# Altium schematic sheet ESP32.SchDoc
size A4
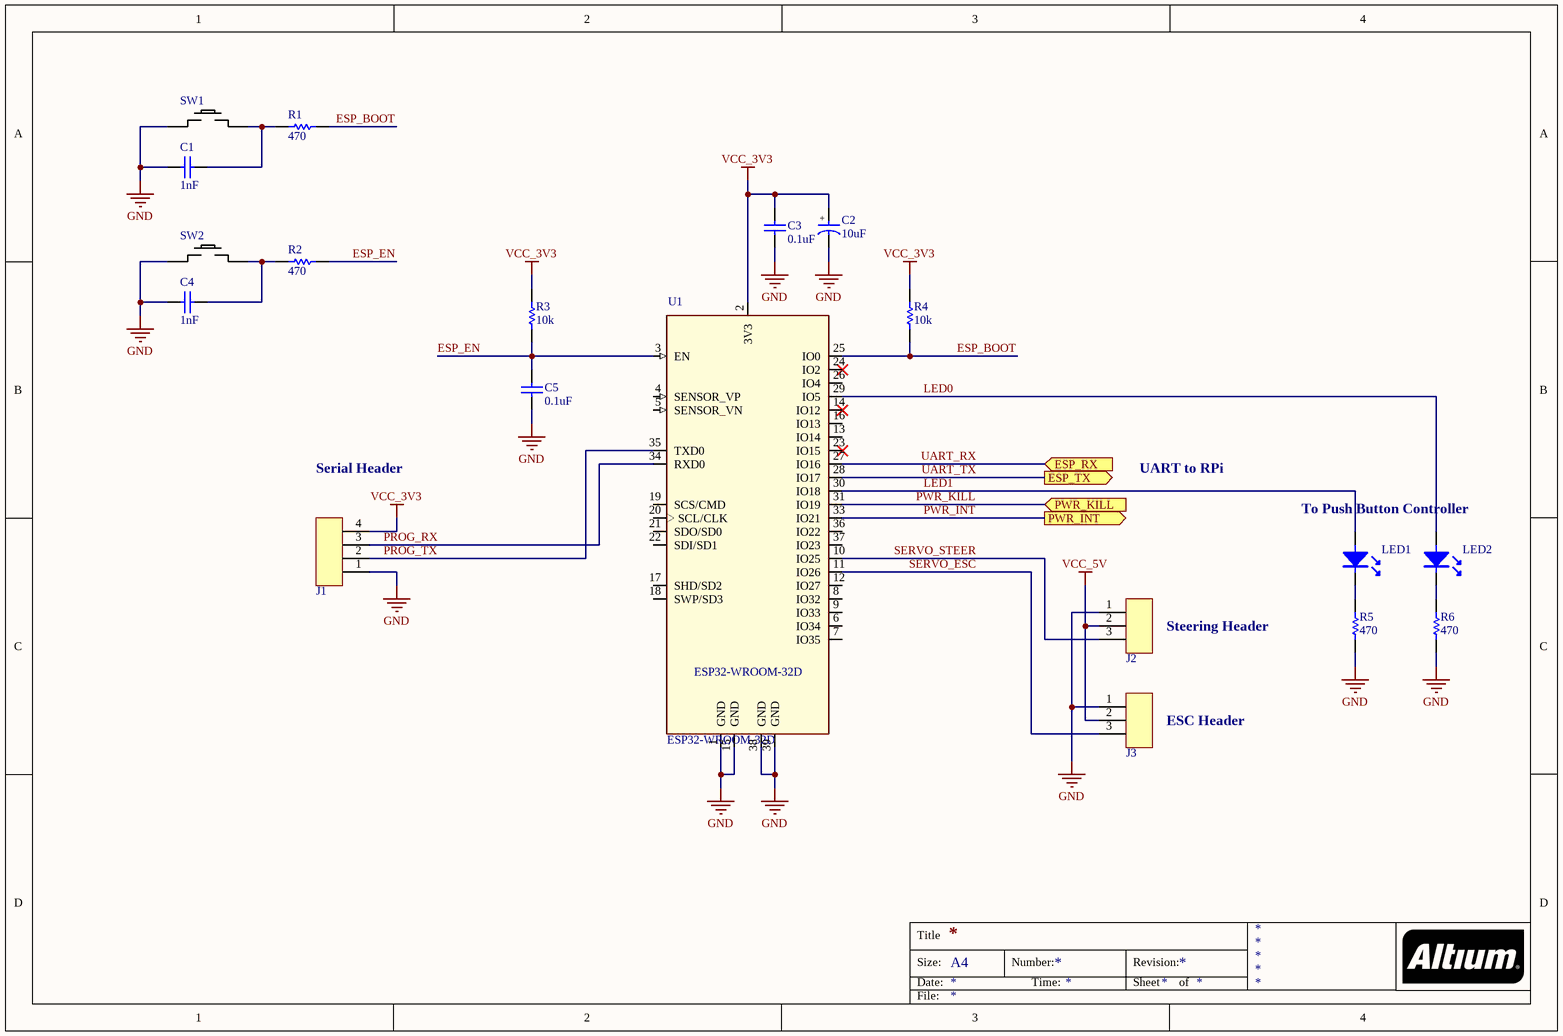
[diagram p0: ESP32.SchDoc]

## Parts
C1  value 1nF  [C0603]  (hidden comment: CAP)
C2  value 10uF  [CASE-A]  (hidden comment: CAP-P)
C3  value 0.1uF  [C0603]  (hidden comment: CAP)
C4  value 1nF  [C0603]  (hidden comment: CAP)
C5  value 0.1uF  [C0603]  (hidden comment: CAP)
J1  HDR_1x4  [PINHEAD_2.54mm_1x4]  (value not drawn)
J2  HDR_1x3  [PINHEAD_2.54mm_1x3]  (value not drawn)
J3  HDR_1x3  [PINHEAD_2.54mm_1x3]  (value not drawn)
LED1  LED  [0603-LED]  (value not drawn)
LED2  LED  [0603-LED]  (value not drawn)
R1  value 470  [R0603]  (hidden comment: RES)
R2  value 470  [R0603]  (hidden comment: RES)
R3  value 10k  [R0603]  (hidden comment: RES)
R4  value 10k  [R0603]  (hidden comment: RES)
R5  value 470  [R0603]  (hidden comment: RES)
R6  value 470  [R0603]  (hidden comment: RES)
SW1  TACTILE_BUTTON  [TACTILE_BUTTOn]  (value not drawn)
SW2  TACTILE_BUTTON  [TACTILE_BUTTOn]  (value not drawn)
U1  ESP32-WROOM-32D  [ESP32-WROOM-32D]

## Ports
ESP_RX (in), ESP_TX (out), PWR_INT (out), PWR_KILL (in)

## Nets
GND: C1.1 C2.2 C3.2 C4.1 C5.2 J1.1 J2.1 J3.1 R5.2 R6.2 SW1.1 SW2.1 U1.1(GND) U1.15(GND) U1.38(GND) U1.39(GND)
VCC_3V3: C2.1 C3.1 J1.4 R3.1 R4.1 U1.2(3V3)
VCC_5V: J2.2 J3.2
ESP_BOOT: R1.2 R4.2 U1.25(IO0)
ESP_EN: C5.1 R2.2 R3.2 U1.3(EN)
LED0: LED2.A U1.29(IO5)
LED1: LED1.A U1.30(IO18)
PROG_RX: J1.3 U1.34(RXD0)
PROG_TX: J1.2 U1.35(TXD0)
PWR_INT: U1.33(IO21) ; port PWR_INT
PWR_KILL: U1.31(IO19) ; port PWR_KILL
SERVO_ESC: J3.3 U1.11(IO26)
SERVO_STEER: J2.3 U1.10(IO25)
UART_RX: U1.27(IO16) ; port ESP_RX
UART_TX: U1.28(IO17) ; port ESP_TX
NetC1_2: C1.2 R1.1 SW1.2
NetC4_2: C4.2 R2.1 SW2.2
NetLED1_K: LED1.K R5.1
NetLED2_K: LED2.K R6.1

Not connected (* = marked no-connect by the designer): U1 4(SENSOR_VP) 5(SENSOR_VN) 6(IO34) 7(IO35) 8(IO32) 9(IO33) 12(IO27) 13(IO14) 14(IO12)* 16(IO13) 17(SHD/SD2) 18(SWP/SD3) 19(SCS/CMD) 20(SCL/CLK) 21(SDO/SD0) 22(SDI/SD1) 23(IO15)* 24(IO2)* 26(IO4) 36(IO22) 37(IO23)

## Notes on the sheet
- Serial Header
- UART to RPi
- To Push Button Controller
- (near J2) Steering Header
- (near J3) ESC Header
- Title
- Size:
- Date:
- A4
- Number:
- Time:
- Revision:
- Sheet
- of
- File:
- (in symbol CAP-P) +

## Library data of the parts
C1 C4 = CAP: =Description; Voltage: =Voltage
C2 = CAP-P: =Description; Voltage: =Voltage
C3 C5 = CAP: =Description; Voltage: 25V
J1 = HDR_1x4: =Description
J2 J3 = HDR_1x3: =Description
LED1 LED2 = LED: Part_Number: 150060RS75000
R1-R6 = RES: =Description
U1 = ESP32-WROOM-32D: IC: SoC; GPIO, I2C, I2S, IR, SD, SDIO, SPI, UART; 2.7Ã·3.6VDC; 20dBm; Part_Number: ESP-WROOM-32D; MF: Espressif Systems; MP: ESP32-WROOM-32D; Package: Module Espressif Systems; Price: None; Availability: Unavailable; SnapEDA_Link: https://www.snapeda.com/parts/ESP32-WROOM-32D/Espressif%20Systems/view-part/?ref=snap; Value: *